# EAGLE design schem_SMS-dumper_low (EAGLE 7.3.0)
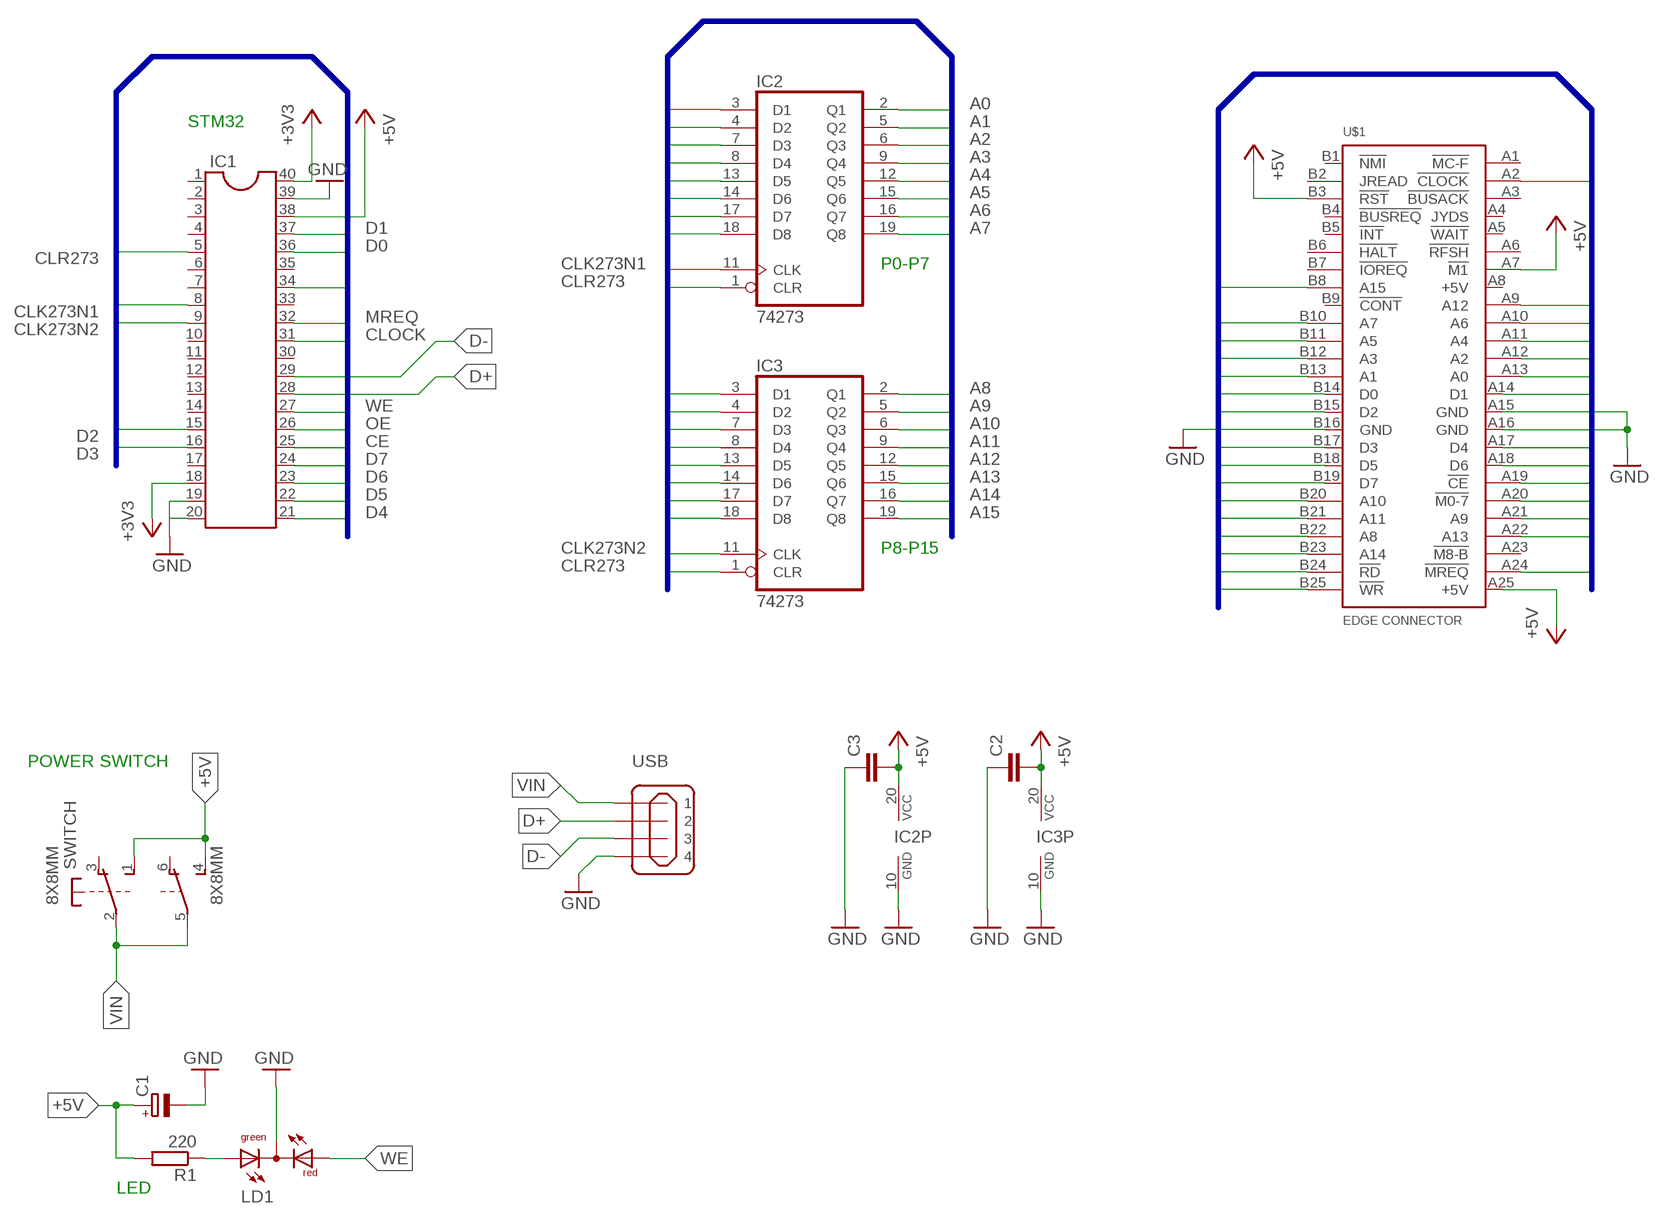
[diagram p0: schematic, sheet 1]

## Parts
8X8MM  SWITCH  PVA2  [PVA2F]
C1  CPOL-EUE2,5-6E  [E2,5-6E]
C2  C-EU050-024X044  [C050-024X044]
C3  C-EU050-024X044  [C050-024X044]
IC1  DIL40  [DIL40]
IC2  74273  74HC273N  [DIL20]
IC3  74273  74HC273N  [DIL20]
LD1  DUOLED-RG-C  [DUOLED-C-5MM]
R1  220  R-EU_0204/7  [0204/7]
U$1  EDGE CONNECTOR  ESMSF  [CARD50F]
USB  MINI-USB_4P-85-32004-10X  [85-32004-10X]

## Nets
+3V3: IC1.18 IC1.40
+5V: 8X8MM.1(1:S) 8X8MM.4(2:S) C1.+ C2.2 C3.2 IC1.38 IC2.20(VCC) IC3.20(VCC) R1.2 U$1.A7(!M1) U$1.A25(+5V) U$1.B3(!RST)
A0: IC2.2(Q1) U$1.A13(A0)
A1: IC2.5(Q2) U$1.B13(A1)
A2: IC2.6(Q3) U$1.A12(A2)
A3: IC2.9(Q4) U$1.B12(A3)
A4: IC2.12(Q5) U$1.A11(A4)
A5: IC2.15(Q6) U$1.B11(A5)
A6: IC2.16(Q7) U$1.A10(A6)
A7: IC2.19(Q8) U$1.B10(A7)
A8: IC3.2(Q1) U$1.B22(A8)
A9: IC3.5(Q2) U$1.A21(A9)
A10: IC3.6(Q3) U$1.B20(A10)
A11: IC3.9(Q4) U$1.B21(A11)
A12: IC3.12(Q5) U$1.A9(A12)
A13: IC3.15(Q6) U$1.A22(A13)
A14: IC3.16(Q7) U$1.B23(A14)
A15: IC3.19(Q8) U$1.B8(A15)
CE: IC1.25 U$1.A19(!CE)
CLK273N1: IC1.8 IC2.11(CLK)
CLK273N2: IC1.9 IC3.11(CLK)
CLOCK: IC1.31 U$1.A2(!CLOCK)
CLR273: IC1.5 IC2.1(CLR) IC3.1(CLR)
D0: IC1.36 IC2.3(D1) IC3.3(D1) U$1.B14(D0)
D1: IC1.37 IC2.4(D2) IC3.4(D2) U$1.A14(D1)
D2: IC1.15 IC2.7(D3) IC3.7(D3) U$1.B15(D2)
D3: IC1.16 IC2.8(D4) IC3.8(D4) U$1.B17(D3)
D4: IC1.21 IC2.13(D5) IC3.13(D5) U$1.A17(D4)
D5: IC1.22 IC2.14(D6) IC3.14(D6) U$1.B18(D5)
D6: IC1.23 IC2.17(D7) IC3.17(D7) U$1.A18(D6)
D7: IC1.24 IC2.18(D8) IC3.18(D8) U$1.B19(D7)
D+: IC1.28 USB.2
D-: IC1.29 USB.3
GND: C1.- C2.1 C3.1 IC1.19 IC1.20 IC1.39 IC2.10(GND) IC3.10(GND) U$1.A15(GND) U$1.A16(GND) U$1.B16(GND) USB.4
M0-7: IC1.34 U$1.A20(!M0-7)
MREQ: IC1.32 U$1.A24(!MREQ)
N$1: LD1.AX(AG) R1.1
OE: IC1.26 U$1.B24(!RD)
VIN: 8X8MM.2(1:P) 8X8MM.5(2:P) USB.1
WE: IC1.27 LD1.AR U$1.B25(!WR)
Unconnected: 8X8MM.3(1:O) 8X8MM.6(2:O) IC1.1 IC1.2 IC1.3 IC1.4 IC1.6 IC1.7 IC1.10 IC1.11 IC1.12 IC1.13 IC1.14 IC1.17 IC1.30 IC1.33 IC1.35 LD1.C U$1.A1(!MC-F) U$1.A3(!BUSACK) U$1.A4(JYDS) U$1.A5(!WAIT) U$1.A6(!RFSH) U$1.A8(+5V) U$1.A23(!M8-B) U$1.B1(!NMI) U$1.B2(JREAD) U$1.B4(!BUSREQ) U$1.B5(!INT) U$1.B6(!HALT) U$1.B7(!IOREQ) U$1.B9(!CONT)

## Buses
CLR273,CLK273N1,CLK273N2,CLK273N3,A[0..18],OE,CE,WE,D[0..7],MREQ,CLOCK,M0-7

## Notes on the sheet
- STM32
- P0-P7
- P8-P15
- POWER SWITCH
- LED

## Library data of the parts
8X8MM = switch-misc:PVA2: ITT SWITCH
C1 = resistor:CPOL-EU: POLARIZED CAPACITOR, European symbol
C2 C3 = rcl:C-EU: CAPACITOR, European symbol
IC1 = ic-package:DIL40: Dual In Line
IC2 IC3 = 74xx-eu:74*273: Octal D type FLIP FLOP, clear
LD1 = led:DUOLED-RG-C: DUO LED 2 colors (red/green), 5 mm, round, common Cathode www.ligitek.com or other producers.
R1 = resistor:R-EU_: RESISTOR, European symbol
U$1 = sega_parts:ESMS: Sega Master System, outside Japan/Korea, cartridge port The ordering of the address and data pins allows for simple connection to common ROM and EPROM chips. description taken from SMSPower.org µ 2011.01.19 D Lue Choy
USB = con-cypressindustries:MINI-USB_4P-: MINI USB 4 Pol. Source: www.cypressindustries.com; OC_FARNELL: unknown; OC_NEWARK: unknown

## Board
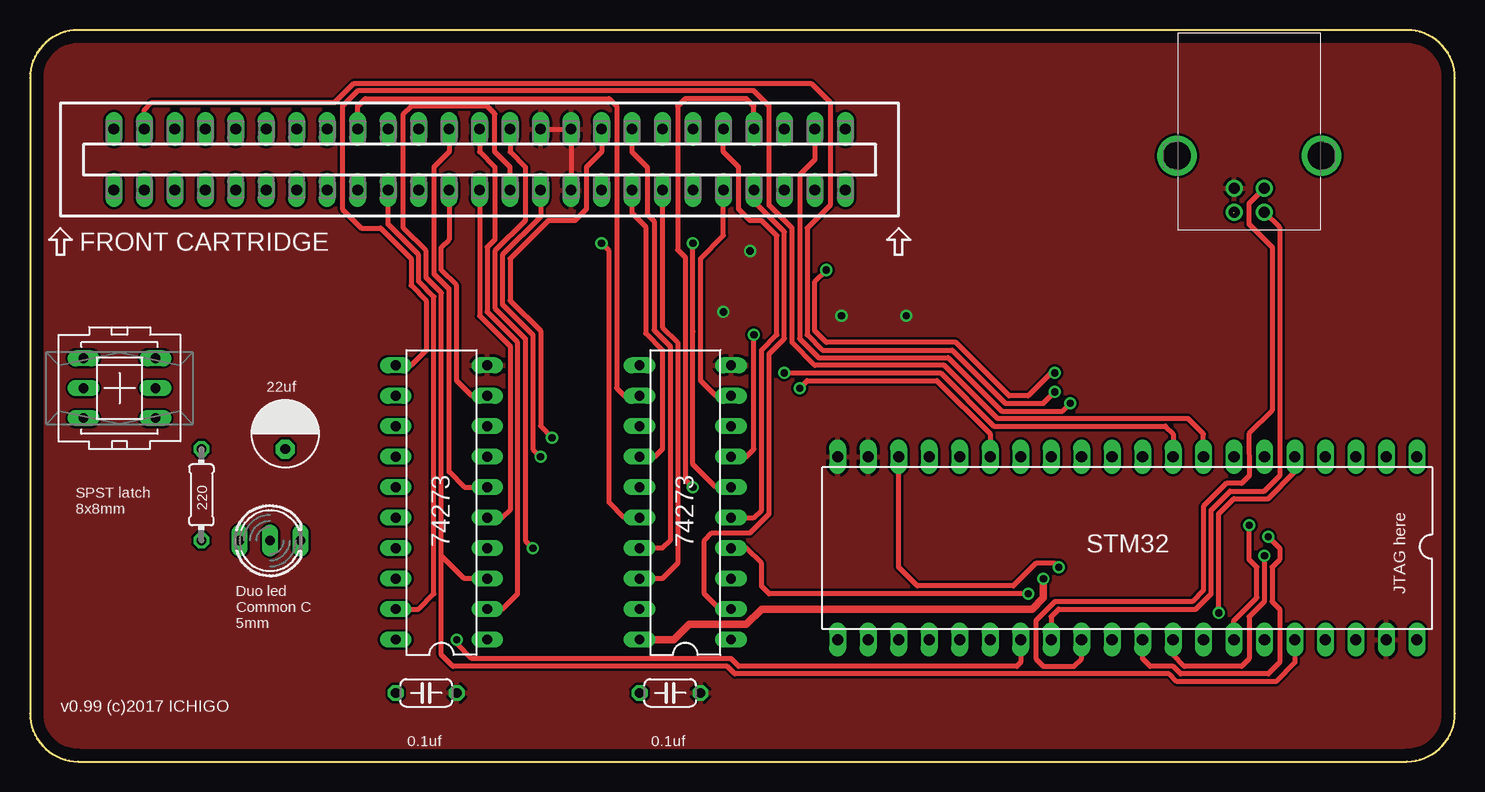
[diagram p1: board, top side]
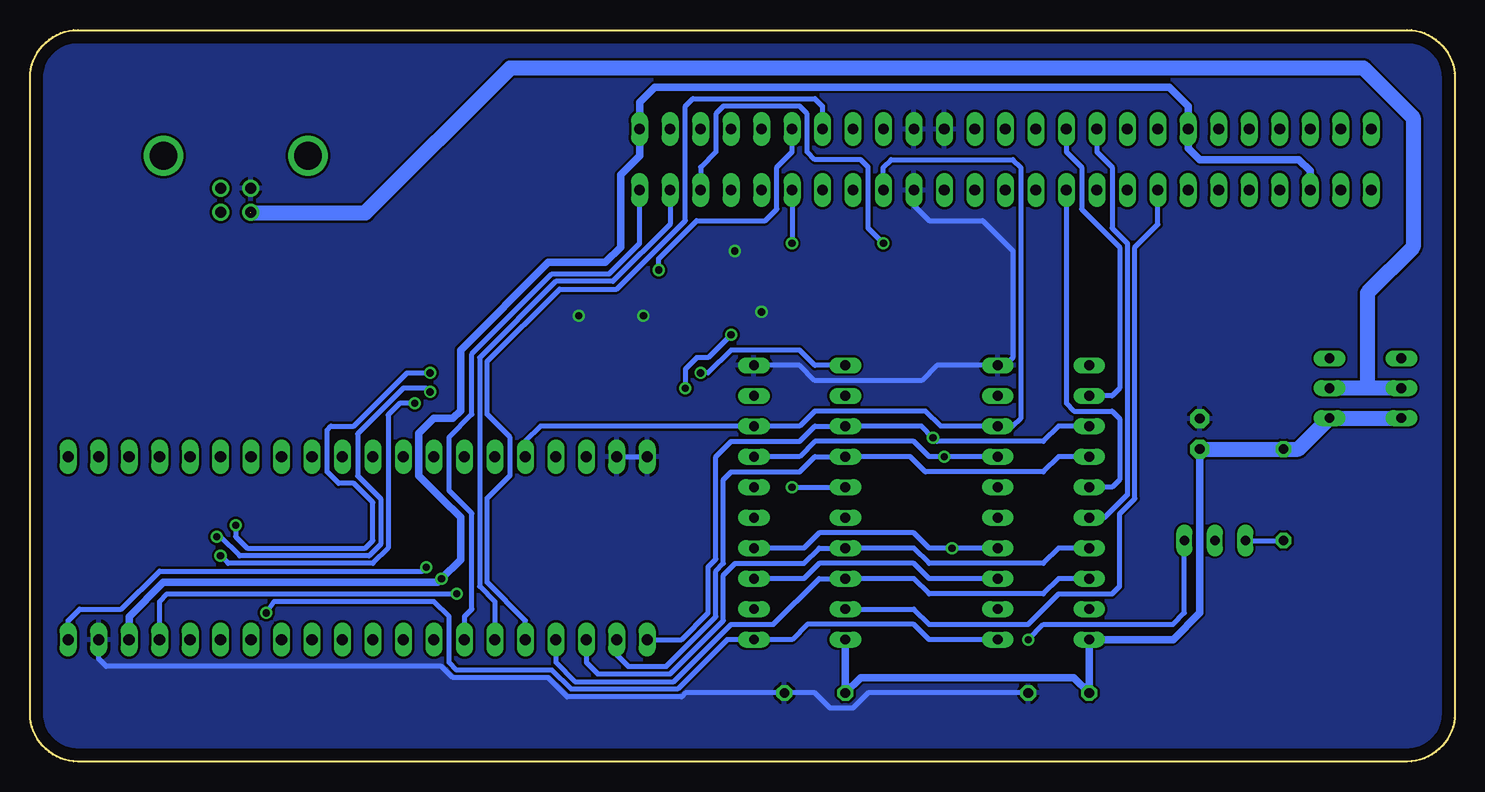
[diagram p2: board, bottom side, seen from below]

Size 118.74 x 60.96 mm. Coordinates in mm from the lower left corner, seen from the top.
Outline: 0,56.96 0,4 arc90 4,0 114.74,0 arc90 118.74,4 118.74,56.96 arc90 114.74,60.96 4,60.96 arc90 0,56.96
Copper layers (1*16): Top 0.035mm / dielectric 1.5mm / Bottom 0.035mm
Design rules "default": minimum track width 10mil, minimum drill 24mil, track to track 8mil, track to pad 8mil, pad to pad 8mil, via to via 8mil, smd to smd 8mil, copper to edge 40mil, drill to drill 8mil, minimum pad ring 10mil, minimum via ring 8mil, stop-mask expansion 4mil, vias tented up to drill 0mil, thermal gap 10mil

### Footprints (pad centres in the part's own frame; a part is rotated, then mirrored left to right if it is on the bottom)
PVA2F = drill 0.813 long: 1 -2.997,2.489; 2 -2.997,0; 3 -2.997,-2.489; 4 2.997,2.489; 5 2.997,0; 6 2.997,-2.489
E2,5-6E = drill 0.813 pad 1.575 octagon: + -1.27,0; - 1.27,0
C050-024X044 = drill 0.813 octagon: 1 -2.54,0; 2 2.54,0
DIL40 = drill 0.927 long: 1 -24.13,-7.62; 2 -21.59,-7.62; 3 -19.05,-7.62; 4 -16.51,-7.62; 5 -13.97,-7.62; 6 -11.43,-7.62; 7 -8.89,-7.62; 8 -6.35,-7.62; 9 -3.81,-7.62; 10 -1.27,-7.62; 11 1.27,-7.62; 12 3.81,-7.62; 13 6.35,-7.62; 14 8.89,-7.62; 15 11.43,-7.62; 16 13.97,-7.62; 17 16.51,-7.62; 18 19.05,-7.62; 19 21.59,-7.62; 20 24.13,-7.62; 21 24.13,7.62; 22 21.59,7.62; 23 19.05,7.62; 24 16.51,7.62; 25 13.97,7.62; 26 11.43,7.62; 27 8.89,7.62; 28 6.35,7.62; 29 3.81,7.62; 30 1.27,7.62; 31 -1.27,7.62; 32 -3.81,7.62; 33 -6.35,7.62; 34 -8.89,7.62; 35 -11.43,7.62; 36 -13.97,7.62; 37 -16.51,7.62; 38 -19.05,7.62; 39 -21.59,7.62; 40 -24.13,7.62
DIL20 = drill 0.813 long: 1 -11.43,-3.81; 2 -8.89,-3.81; 3 -6.35,-3.81; 4 -3.81,-3.81; 5 -1.27,-3.81; 6 1.27,-3.81; 7 3.81,-3.81; 8 6.35,-3.81; 9 8.89,-3.81; 10 11.43,-3.81; 11 11.43,3.81; 12 8.89,3.81; 13 6.35,3.81; 14 3.81,3.81; 15 1.27,3.81; 16 -1.27,3.81; 17 -3.81,3.81; 18 -6.35,3.81; 19 -8.89,3.81; 20 -11.43,3.81
DUOLED-C-5MM = drill 0.813 long: AR 2.54,0; AX -2.54,0; C 0,0
0204/7 = drill 0.813 octagon: 1 -3.81,0; 2 3.81,0
CARD50F = drill 0.9 long: A1 30.48,-2.54; A2 27.94,-2.54; A3 25.4,-2.54; A4 22.86,-2.54; A5 20.32,-2.54; A6 17.78,-2.54; A7 15.24,-2.54; A8 12.7,-2.54; A9 10.16,-2.54; A10 7.62,-2.54; A11 5.08,-2.54; A12 2.54,-2.54; A13 0,-2.54; A14 -2.54,-2.54; A15 -5.08,-2.54; A16 -7.62,-2.54; A17 -10.16,-2.54; A18 -12.7,-2.54; A19 -15.24,-2.54; A20 -17.78,-2.54; A21 -20.32,-2.54; A22 -22.86,-2.54; A23 -25.4,-2.54; A24 -27.94,-2.54; A25 -30.48,-2.54; B1 30.48,2.54; B2 27.94,2.54; B3 25.4,2.54; B4 22.86,2.54; B5 20.32,2.54; B6 17.78,2.54; B7 15.24,2.54; B8 12.7,2.54; B9 10.16,2.54; B10 7.62,2.54; B11 5.08,2.54; B12 2.54,2.54; B13 0,2.54; B14 -2.54,2.54; B15 -5.08,2.54; B16 -7.62,2.54; B17 -10.16,2.54; B18 -12.7,2.54; B19 -15.24,2.54; B20 -17.78,2.54; B21 -20.32,2.54; B22 -22.86,2.54; B23 -25.4,2.54; B24 -27.94,2.54; B25 -30.48,2.54
85-32004-10X = drill 0.92 pad 1.27: 1 4.71,-1.25; 2 4.71,1.25; 3 2.71,1.25; 4 2.71,-1.25 | drill 2.3 pad 3: M1 0,6.02; M2 0,-6.02

### Placement (x,y rotation side)
8X8MM  7.46,31.12 180 top
C1  21.27,27.3 90 top
C2  33.02,5.72 180 top
C3  53.34,5.72 180 top
IC1  91.44,17.78 180 top
IC2  34.29,21.59 90 top
IC3  54.61,21.59 90 top
LD1  20,18.42 0 top
R1  14.29,22.23 90 top
U$1  37.46,50.16 180 top
USB  101.6,50.48 270 top

### Tracks (layer width: path | path; a pad name or v marks a point on that pad's centre or on a via)
+3V3  (via drill 0.6)
  Top 0.406: v85.72,16.19 85.41,16.51 83.82,16.51 81.95,14.64 73.95,14.64 72.39,16.19 IC1.18
  Bottom 0.406: IC1.40 115.57,11.75 114.62,12.7 111.13,12.7 107.95,15.87 86.04,15.87 v85.72,16.19
+5V  (via drill 0.6)
  Top 0.61: IC3.20 53.66,10.16 54.93,11.43 59.69,11.43 60.96,12.7 83.5,12.7 84.46,13.65 v84.46,15.24
  Bottom 0.61: IC3.20 C3.2 49.53,6.99 31.75,6.99 C2.2 IC2.20 23.5,10.16 21.27,12.38 C1.+ | IC1.38 110.49,12.07 107.63,14.92 84.77,14.92 v84.46,15.24 82.87,16.83 82.87,20.35 84.42,21.91 85.72,23.18 86.36,23.81 86.36,27.34 85.09,28.61 83.5,28.61 82.87,29.24 82.87,34.29 75.57,41.59 70.8,41.59 69.53,42.86 69.53,48.9 67.94,50.48 U$1.A25 67.94,54.93 66.67,56.2 23.81,56.2 22.23,54.61 U$1.A7 22.23,51.12 21.27,50.16 13.02,50.16 12.07,49.21 U$1.B3
  Bottom 1.27: 8X8MM.4 8X8MM.1 13.05,26.04 R1.2 C1.+
A0
  Top 0.406: IC2.2 39.37,12.7 40.64,13.97 40.64,34.93 38.1,37.47 38.1,42.86 38.73,43.5 38.73,49.53 37.47,50.8 U$1.A13
A1
  Top 0.406: U$1.B13 37.47,37.15 40.01,34.61 40.01,20.96 39.37,20.32 IC2.5
A2
  Top 0.406: U$1.A12 34.92,50.8 33.66,49.53 33.66,40.64 34.92,39.37 34.92,24.13 36.19,22.86 IC2.6
A3
  Top 0.406: U$1.B12 34.92,43.5 34.29,42.86 34.29,40.96 35.56,39.69 35.56,31.75 36.83,30.48 IC2.9
A4
  Bottom 0.406: U$1.A11 32.39,50.8 31.11,49.53 31.11,46.04 27.94,42.86 27.94,31.12 28.58,30.48 IC2.12
A5
  Bottom 0.406: U$1.B11 32.39,29.84 31.75,29.21 28.58,29.21 27.94,28.58 27.94,23.49 28.58,22.86 IC2.15
A6
  Bottom 0.406: U$1.A10 29.84,50.8 28.58,49.53 28.58,44.45 27.31,43.18 27.31,22.23 29.21,20.32 IC2.16
A7
  Top 0.406: IC2.19 32.39,12.7 33.66,13.97 33.66,38.73 32.39,40.01 32.39,42.23 29.84,44.77 U$1.B10
A8
  Top 0.406: IC3.2 57.47,12.7 56.2,13.97 56.2,18.42 56.83,19.05 60.01,19.05 61.6,20.64 61.6,33.97 62.87,35.24 62.87,44.13 60.32,46.67 U$1.B22
A9
  Top 0.406: IC3.5 60.32,20.32 60.96,20.96 60.96,34.29 62.23,35.56 62.23,43.81 60.96,45.08 60.01,45.08 59.05,46.04 59.05,49.53 57.78,50.8 U$1.A21
A10  (via drill 0.6)
  Top 0.406: IC3.6 57.15,22.86 55.25,24.76 55.25,35.85 55.21,35.88 55.21,42.86 v55.25,43.18
  Bottom 0.406: U$1.B20 v55.25,43.18
A11
  Top 0.406: IC3.9 57.15,30.48 55.88,31.75 55.88,41.91 57.78,43.81 U$1.B21
A12
  Top 0.406: U$1.A9 27.31,54.61 27.94,55.25 48.26,55.25 48.89,54.61 48.89,31.12 49.53,30.48 IC3.12
A13  (via drill 0.6)
  Top 0.406: v55.25,22.86 54.61,23.49 54.61,42.01 53.98,42.64 53.98,54.61 54.61,55.25 59.69,55.25 60.32,54.61 U$1.A22
  Bottom 0.406: v55.25,22.86 IC3.15
A14  (via drill 0.6)
  Top 0.406: IC3.16 49.53,20.32 48.26,21.59 48.26,42.55 v47.63,43.18
  Bottom 0.406: v47.63,43.18 48.89,44.45 48.89,49.53 49.53,50.16 53.34,50.16 53.98,50.8 53.98,53.98 54.61,54.61 60.96,54.61 61.6,53.98 61.6,50.8 62.87,49.53 U$1.B23
A15
  Bottom 0.406: IC3.19 45.09,12.7 43.82,11.43 35.56,11.43 33.02,13.97 28.58,13.97 27.94,14.6 27.94,20.64 26.67,21.91 26.67,42.86 24.76,44.77 U$1.B8
CE
  Bottom 0.406: IC1.25 77.47,11.75 80.64,14.92 80.64,21.94 78.74,23.84 78.74,27.02 80.64,28.92 80.64,33.34 74.61,39.37 69.85,39.37 64.14,45.08 64.14,54.61 63.5,55.25 53.34,55.25 52.7,54.61 U$1.A19
CLK273N1
  Top 0.406: IC1.8 97.79,27.3 96.52,28.58 80.64,28.58 76.2,33.02 65.41,33.02 63.5,34.93 63.5,44.45 61.6,46.36 61.6,54.61 60.32,55.88 27.31,55.88 26.03,54.61 26.03,46.04 27.62,44.45 29.21,44.45 31.75,41.91 31.75,39.69 33.02,38.42 33.02,34.29 31.75,33.02 IC2.11
CLK273N2  (via drill 0.6)
  Top 0.406: v62.87,32.38 75.88,32.38 80.33,27.94 94.61,27.94 95.25,27.3 IC1.9
  Bottom 0.406: IC3.11 53.34,33.02 54.61,34.29 60.32,34.29 62.23,32.38 v62.87,32.38
CLOCK  (via drill 0.6)
  Top 0.406: U$1.A2 9.53,54.29 10.16,54.93 25.4,54.93 26.99,56.51 65.09,56.51 66.67,54.93 66.67,46.36 64.77,44.45 64.77,35.56 66.04,34.29 76.83,34.29 81.28,29.84 84.46,29.84 v85.41,30.8 | v103.19,18.73 104.14,17.78 104.14,16.83 103.5,16.19 103.5,13.33 104.14,12.7 104.14,8.25 103.19,7.3 95.89,7.3 95.25,7.94 93.35,7.94 92.71,8.57 IC1.31
  Bottom 0.406: v85.41,30.8 85.72,31.12 87.63,31.12 91.44,27.3 91.44,23.81 89.53,21.91 89.53,18.1 90.49,17.14 101.28,17.14 102.87,18.73 v103.19,18.73
CLR273  (via drill 0.6)
  Top 0.406: v99.06,12.38 99.06,20.64 100.33,21.91 103.19,21.91 105.41,24.13 IC1.5
  Bottom 0.406: IC2.1 43.82,10.16 45.09,11.43 53.98,11.43 55.25,10.16 IC3.1 60.64,10.16 64.77,6.03 73.66,6.03 75.25,7.62 83.18,7.62 83.82,8.25 83.82,12.07 85.09,13.33 98.42,13.33 v99.06,12.38
D0
  Top 0.406: IC2.3 36.19,15.24 34.29,17.14 | 34.29,17.14 34.29,39.05 33.02,40.32 33.02,42.55 31.11,44.45 31.11,53.98 31.75,54.61 38.1,54.61 38.73,53.98 38.73,50.8 40.01,49.53 U$1.B14 | IC1.36 105.41,8.25 103.82,6.67 95.57,6.67 94.93,7.3 58.74,7.3 58.1,7.94 35.24,7.94 34.29,8.89 34.29,17.14
  Bottom 0.406: IC2.3 43.82,15.24 45.09,16.51 52.99,16.51 54.26,15.24 IC3.3
D1  (via drill 0.6)
  Top 0.406: U$1.A14 40.01,50.8 41.28,49.53 41.28,45.08 38.73,42.55 38.73,37.78 41.28,35.24 41.28,18.42 v41.91,17.78 | v83.18,13.97 61.6,13.97 60.96,14.6 60.96,16.51 59.69,17.78 IC3.4
  Bottom 0.406: IC2.4 v41.91,17.78 43.82,17.78 45.09,19.05 52.99,19.05 54.26,17.78 IC3.4 | IC1.37 107.95,13.33 107.32,13.97 v83.18,13.97
D2  (via drill 0.6)
  Top 0.406: U$1.B15 42.54,45.4 39.37,42.23 39.37,38.1 41.91,35.56 41.91,26.04 v42.54,25.4 | IC3.7 59.69,25.4 60.32,26.04 v60.32,35.56 | IC1.15 80.01,27.3 75.57,31.75 64.77,31.75 v64.14,31.12
  Bottom 0.406: IC2.7 v42.54,25.4 43.82,25.4 45.09,26.67 53.34,26.67 54.61,25.4 IC3.7 | v60.32,35.56 62.23,33.66 63.18,33.66 64.14,32.7 v64.14,31.12
D3
  Bottom 0.406: U$1.B17 47.63,49.53 46.99,50.16 36.83,50.16 36.19,49.53 36.19,28.58 36.83,27.94 IC2.8 42.86,27.94 44.13,29.21 53.34,29.21 54.61,27.94 IC3.8 76.2,27.94 77.47,26.67 IC1.16
D4  (via drill 0.6)
  Top 0.406: U$1.A17 47.63,50.8 46.36,49.53 46.36,46.04 45.4,45.08 43.18,45.08 40.01,41.91 40.01,38.42 42.54,35.88 42.54,27.94 v43.5,26.99
  Bottom 0.406: IC2.13 33.02,27.94 34.29,26.67 43.18,26.67 v43.5,26.99 44.45,27.94 IC3.13 53.34,27.94 54.61,26.67 60.32,26.67 61.6,25.4 61.6,16.86 62.23,16.22 62.23,12.38 64.45,10.16 IC1.21
D5
  Top 0.406: U$1.B18 50.17,45.72 51.31,44.58 51.31,35.69 52.7,34.29 52.7,26.04 52.07,25.4 IC3.14
  Bottom 0.406: IC2.14 33.02,25.4 34.29,24.13 44.13,24.13 45.4,25.4 IC3.14 53.34,25.4 54.61,24.13 60.32,24.13 60.96,23.49 60.96,16.51 61.6,15.87 61.6,12.07 65.72,7.94 68.9,7.94 69.85,8.89 IC1.22
D6
  Top 0.406: U$1.A18 50.17,50.8 51.43,49.53 51.43,45.59 52.01,45.02 52.01,35.94 53.34,34.61 53.34,18.42 52.7,17.78 IC3.17
  Bottom 0.406: IC2.17 33.02,17.78 34.29,16.51 43.82,16.51 45.09,17.78 IC3.17 52.99,17.78 54.26,16.51 59.98,16.51 60.96,15.53 60.96,11.75 65.41,7.3 71.44,7.3 72.39,8.25 IC1.23
D7
  Top 0.406: U$1.B19 52.7,36.19 53.98,34.93 53.98,16.51 52.7,15.24 IC3.18
  Bottom 0.406: IC2.18 33.02,15.24 34.29,13.97 43.82,13.97 45.09,15.24 IC3.18 52.99,15.24 56.8,11.43 60.32,11.43 65.09,6.67 73.34,6.67 74.93,8.25 IC1.24
D+
  Top 0.406: USB.2 104.14,44.52 104.14,23.81 102.87,22.54 100.01,22.54 98.42,20.96 98.42,13.97 97.15,12.7 85.72,12.7 85.09,12.07 IC1.28
D-
  Top 0.406: USB.3 101.6,46.52 101.6,44.77 103.5,42.86 103.5,29.24 101.57,27.3 101.6,23.81 100.96,23.18 99.7,23.18 97.79,21.27 97.79,14.29 96.84,13.33 85.41,13.33 83.82,11.75 83.82,8.57 84.46,7.94 87,7.94 87.63,8.57 IC1.29
GND  (via drill 0.6)
  Top 0.406: U$1.A15 U$1.A16 U$1.B16
  Bottom 0.406: IC3.10 54.61,33.02 53.34,31.75 44.45,31.75 43.18,33.02 IC2.10 37.47,33.02 36.83,33.66 36.83,42.55 39.37,45.08 43.82,45.08 45.09,46.36 U$1.B16 | C2.1 48.89,5.72 50.17,4.44 52.07,4.44 53.34,5.72 C3.1 64.14,5.72 64.45,5.4 73.98,5.4 75.57,6.99 83.5,6.99 84.46,7.94 112.39,7.94 113.03,8.57 IC1.39 | IC1.19 IC1.20
  other vias: 60.01,42.55 57.78,37.47 67.63,37.15 73.03,37.15
  pour Top: -1.91,63.5 -1.91,-1.27 120.02,-1.27 120.02,62.23
  pour Bottom: -1.91,62.86 -1.91,-1.27 120.02,-1.27 120.02,60.96
M0-7  (via drill 0.6)
  Top 0.406: IC1.34 100.33,11.75 102.24,13.65 102.24,16.19 101.6,16.83 v101.6,19.69 | v85.41,32.38 85.09,32.38 83.18,30.48 81.6,30.48 77.15,34.93 66.36,34.93 65.41,35.88 65.41,40.01 v66.36,40.96
  Bottom 0.406: v101.6,19.69 101.6,18.73 100.65,17.78 90.81,17.78 90.17,18.42 90.17,21.59 91.76,23.18 93.03,23.18 93.98,24.13 93.98,27.62 93.66,27.94 91.76,27.94 87.31,32.38 v85.41,32.38 | v66.36,40.96 66.36,41.91 63.18,45.08 57.47,45.08 56.51,46.04 56.51,49.53 55.25,50.8 U$1.A20
MREQ  (via drill 0.6)
  Top 0.406: U$1.A24 65.41,50.16 64.14,48.9 64.14,35.24 65.72,33.66 76.52,33.66 80.96,29.21 86.04,29.21 v86.68,29.84 | v102.87,17.14 102.87,13.33 101.6,12.07 101.6,8.57 100.96,7.94 96.2,7.94 95.25,8.89 IC1.32
  Bottom 0.406: v86.68,29.84 87.95,29.84 88.9,28.89 88.9,17.78 90.17,16.51 102.24,16.51 v102.87,17.14
N$1
  Bottom 0.406: LD1.AX R1.1
OE
  Bottom 0.406: U$1.B24 65.41,44.77 70.17,40.01 74.93,40.01 81.28,33.66 81.28,14.6 80.01,13.33 IC1.26
VIN  (1 unrouted)
  Bottom 1.27: 100.33,45.72 90.81,45.72 78.74,57.79 7.62,57.79 3.49,53.66 3.49,42.86 7.3,39.05 7.3,31.12 | 8X8MM.5 7.3,31.12 | 7.3,31.12 8X8MM.2
WE  (via drill 0.6)
  Top 0.406: IC1.27 82.55,8.25 82.23,7.94 59.05,7.94 58.42,8.57 36.83,8.57 35.56,9.84 v35.56,10.16
  Bottom 0.406: U$1.B25 67.94,43.18 70.48,40.64 75.25,40.64 81.92,33.97 81.92,28.92 83.82,27.02 83.82,22.57 81.92,20.67 81.92,12.7 82.55,12.07 IC1.27 | v35.56,10.16 34.29,11.43 23.5,11.43 22.54,12.38 LD1.AR

### Text on the board
tPlace: FRONT CARTRIDGE | 22uf | SPST latch / 8x8mm | STM32 | JTAG here | Duo led / Common C / 5mm | 0.1uf | 0.1uf
tNames: v0.99 (c)2017 ICHIGO
tStop: MASTER SYSTEM